# Altium schematic sheet MC_Isolation_Schematic.SchDoc
size A; SheetNumber: 1; SheetTotal: 1
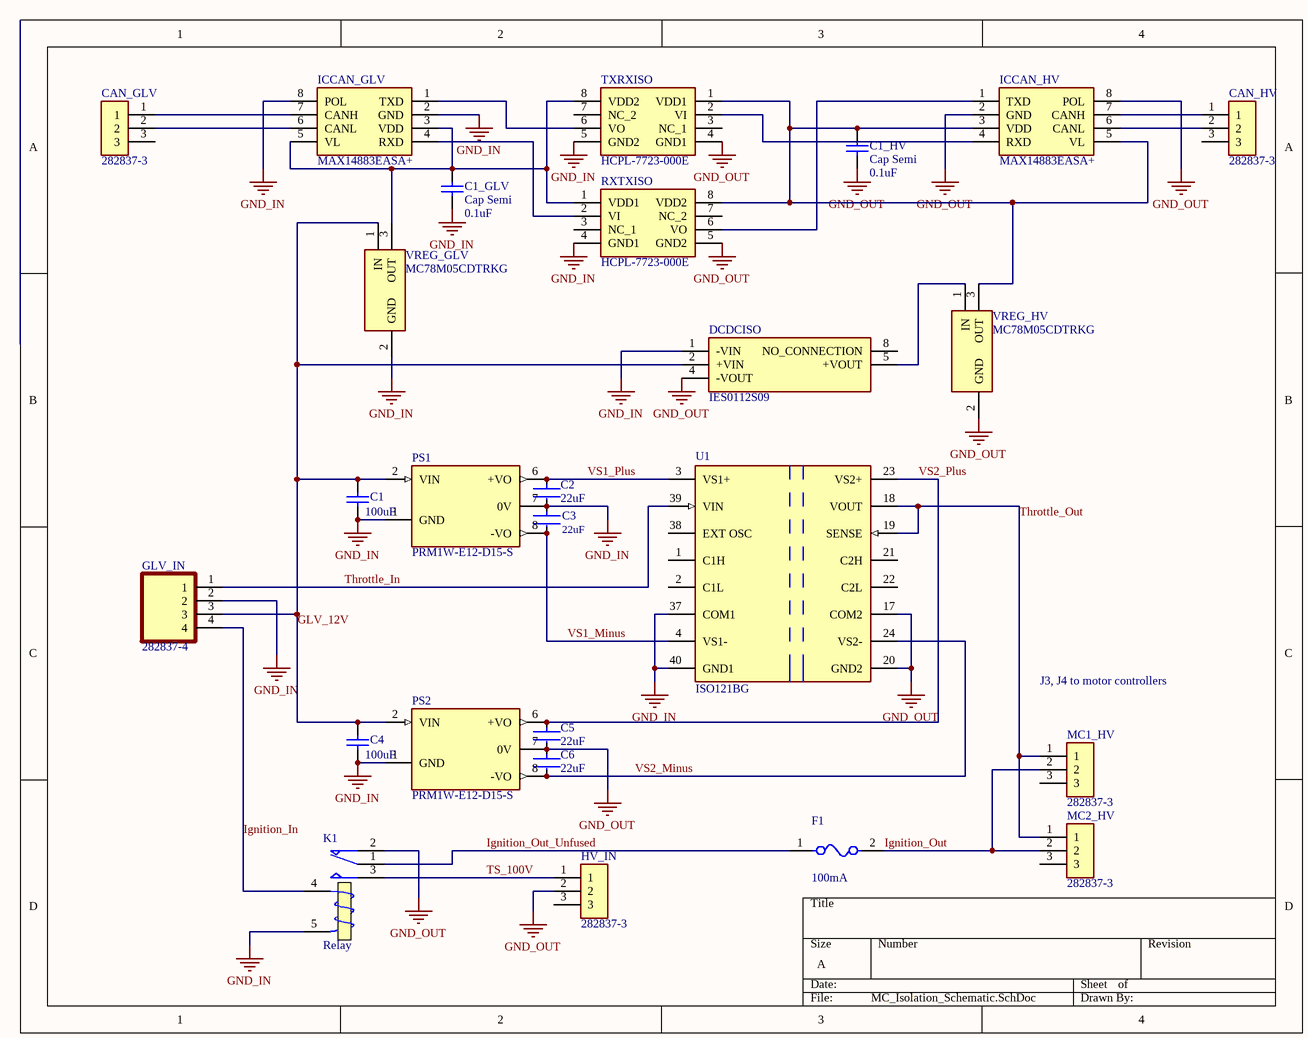
[diagram p0: MC_Isolation_Schematic.SchDoc]

## Parts
C1  100uF  [RAD-0.2]
C1_GLV  Cap Semi  value 0.1uF  [C1206]
C1_HV  Cap Semi  value 0.1uF  [C1206]
C2  22uF  [FP-C3216-160-0_2-IPC_B]
C3  22uF  [FP-C3216-160-0_2-IPC_B]
C4  100uF  [RAD-0.2]
C5  22uF  [FP-C3216-160-0_2-IPC_B]
C6  22uF  [FP-C3216-160-0_2-IPC_B]
CAN_GLV  282837-3  [TE_282837-3]
CAN_HV  282837-3  [TE_282837-3]
DCDCISO  IES0112S09  [IES0105S05H]
F1  100mA  [FP-0154-MFG]
GLV_IN  282837-4  [TE_282837-4]
HV_IN  282837-3  [TE_282837-3]
ICCAN_GLV  MAX14883EASA+  [SOIC127P600X175-8N]
ICCAN_HV  MAX14883EASA+  [SOIC127P600X175-8N]
K1  Relay  [PCBComponent_1]
MC1_HV  282837-3  [TE_282837-3]
MC2_HV  282837-3  [TE_282837-3]
PS1  PRM1W-E12-D15-S  [CONV_PRM1W-E12-D15-S]
PS2  PRM1W-E12-D15-S  [CONV_PRM1W-E12-D15-S]
RXTXISO  HCPL-7723-000E  [DIP762W65P254L965H470Q8N]
TXRXISO  HCPL-7723-000E  [DIP762W65P254L965H470Q8N]
U1  ISO121BG  [FP-JVD0016A-MFG]
VREG_GLV  MC78M05CDTRKG  [LM317MADTRKG]
VREG_HV  MC78M05CDTRKG  [LM317MADTRKG]

## Nets
GND_IN: C1.1 C1_GLV.1 C2.2 C3.1 C4.1 DCDCISO.1(-VIN) GLV_IN.2 ICCAN_GLV.2(GND) ICCAN_GLV.8(POL) K1.5(T2) PS1.1(GND) PS1.7(0V) PS2.1(GND) RXTXISO.4(GND1) TXRXISO.5(GND2) U1.37(COM1) U1.40(GND1) VREG_GLV.2(GND)
GND_OUT: C1_HV.1 C5.2 C6.1 DCDCISO.4(-VOUT) HV_IN.2 ICCAN_HV.2(GND) ICCAN_HV.8(POL) K1.2(NC) PS2.7(0V) RXTXISO.5(GND2) TXRXISO.4(GND1) U1.17(COM2) U1.20(GND2) VREG_HV.2(GND)
GLV_12V: C1.2 C4.2 DCDCISO.2(+VIN) GLV_IN.3 PS1.2(VIN) PS2.2(VIN) VREG_GLV.1(IN)
Ignition_In: GLV_IN.4 K1.4(T1)
Ignition_Out: F1.2 MC1_HV.2 MC2_HV.2
Ignition_Out_Unfused: F1.1 K1.1(COM)
Throttle_In: GLV_IN.1 U1.39(VIN)
Throttle_Out: MC1_HV.1 MC2_HV.1 U1.18(VOUT) U1.19(SENSE)
TS_100V: HV_IN.1 K1.3(NO)
VS1_Minus: C3.2 PS1.8(-VO) U1.4(VS1-)
VS1_Plus: C2.1 PS1.6(+VO) U1.3(VS1+)
VS2_Minus: C6.2 PS2.8(-VO) U1.24(VS2-)
VS2_Plus: C5.1 PS2.6(+VO) U1.23(VS2+)
NetC1_GLV_2: C1_GLV.2 ICCAN_GLV.3(VDD) ICCAN_GLV.5(VL) RXTXISO.1(VDD1) TXRXISO.8(VDD2) VREG_GLV.3(OUT)
NetC1_HV_2: C1_HV.2 ICCAN_HV.3(VDD) ICCAN_HV.5(VL) RXTXISO.8(VDD2) TXRXISO.1(VDD1) VREG_HV.3(OUT)
NetCAN_GLV_1: CAN_GLV.1 ICCAN_GLV.7(CANH)
NetCAN_GLV_2: CAN_GLV.2 ICCAN_GLV.6(CANL)
NetCAN_HV_1: CAN_HV.1 ICCAN_HV.7(CANH)
NetCAN_HV_2: CAN_HV.2 ICCAN_HV.6(CANL)
NetDCDCISO_5: DCDCISO.5(+VOUT) VREG_HV.1(IN)
NetICCAN_GLV_1: ICCAN_GLV.1(TXD) TXRXISO.6(VO)
NetICCAN_GLV_4: ICCAN_GLV.4(RXD) RXTXISO.2(VI)
NetICCAN_HV_1: ICCAN_HV.1(TXD) RXTXISO.6(VO)
NetICCAN_HV_4: ICCAN_HV.4(RXD) TXRXISO.2(VI)

Not connected (* = marked no-connect by the designer): CAN_GLV 3; CAN_HV 3; DCDCISO 8(NO_CONNECTION); HV_IN 3; MC1_HV 3; MC2_HV 3; RXTXISO 3(NC_1) 7(NC_2); TXRXISO 3(NC_1) 7(NC_2); U1 1(C1H) 2(C1L) 21(C2H) 22(C2L) 38(EXT_OSC)

## Notes on the sheet
- J3, J4 to motor controllers

## Library data of the parts
C1 C4 = Cap: Capacitor; Published: 8-Jun-2000; LatestRevisionDate: 17-Jul-2002; LatestRevisionNote: Re-released for DXP Platform.; PackageReference: RAD-0.3; Publisher: Altium Limited; PackageDescription: Radial Cap, Thru-Hole; 2 Leads; 0.3 in Pin Spacing; Value: 100uF
C1_GLV C1_HV = Cap Semi: Capacitor (Semiconductor SIM Model); Published: 8-Jun-2000; LatestRevisionDate: 29-May-2009; LatestRevisionNote: IPC-7351 Footprint Added.; PackageReference: C1206; Publisher: Altium Limited; PackageDescription: Chip Capacitor
C2 C3 C5 C6 = CMP-2000-05402-2: Multilayer Ceramic Capacitors 1uF ±10% 50V X7R SMD 1206; Voltage: 25V; Voltage Rating (DC): 50V; Dielectric: X7R; Number of Pins: 2; Length: 0.126inch; Case Code (Imperial): 1206; Capacitance: 1uF; Package Quantity: 2000; Min Operating Temperature: -55°C; Lead Free: Lead Free; Radiation Hardening: No; Termination: SMD/SMT; Case Code (Metric): 3216; Series: C; Weight: 0.000571oz; REACH SVHC: No SVHC; Tolerance: 10%; Max Operating Temperature: 125°C; RoHS Compliant: Yes; Mount: Surface Mount; Dielectric Material: Ceramic; Packaging: Tape and Reel; Thickness: 0.071inch; Height: 1.6mm; Resistor Type: Ceramic; Width: 0.063inch; Voltage Rating: 50V; Depth: 1.6mm; Case/Package: 1206
CAN_GLV CAN_HV HV_IN MC1_HV MC2_HV = 282837-3: Wire to Board 3 Position 5.08 mm Pitch 30-16 AWG Euro Style Terminal Block; MF: TE Connectivity; Check_prices: https://www.snapeda.com/parts/282837-3/TE%20Connectivity%20AMP%20Connectors/view-part/2765182/?ref=eda; SnapEDA_Link: https://www.snapeda.com/parts/282837-3/TE%20Connectivity%20AMP%20Connectors/view-part/2765182/?ref=snap; Availability: Good; MP: 282837-3; Purchase-URL: https://pricing.snapeda.com/search/part/282837-3/?ref=eda; Package: None; Price: None; Value: *
DCDCISO = IES0105S03: Power Supply; Manufacturer_Name: XP POWER; Datasheet Link: https://www.mouser.com/datasheet/2/942/SF_IES01-1666999.pdf; Height: 7.35mm; Manufacturer_Part_Number: IES0105S03; Mouser Part Number: 209-IES0105S03; Mouser Price/Stock: https://www.mouser.co.uk/ProductDetail/XP-Power/IES0105S03?qs=Cb2nCFKsA8rLXqfTpxCsOw%3D%3D
F1 = CMP-08605-000075-1: FUSE BOARD MNT 100MA 125VAC/VDC; Manufacturer: Littelfuse Inc; Manufacturer Part Number: 0154.100DR; Fuse Current: 0.1A; Fuse I2T: 0.00138A2Sec; Resistance: 3.1Ω; Max Fuse Dc Voltage: 125V; Value: 3.1Ω; Fuse Blow Speed: Fast; Temperature Range High: +125°C; Device Class L1: Circuit Protection; RoHS: TRUE; Lead Free: Yes; ComponentLink2Description: Datasheet; Device Class L3: unset; Digikey Description: FUSE BOARD MNT 100MA 125VAC/VDC; Octopart: https://octopart.com/0154.100dr-littelfuse-557956; Temperature Range Low: -55°C; Mouser Description: Surface Mount Fuses Fuseblck w/ fuse .1A OMNI BLOK 154; Category: Fuse; Max Fuse Ac Voltage: 125V; Height: 3.81mm; Temperature: -55°C to +125°C; Voltage Rating: 125V; Package: 0154; Device Class L2: Fuses; ComponentLink2URL: https://www.littelfuse.com/~/media/electronics/datasheets/fuses/littelfuse_fuse_154_154t_154l_154tl_datasheet.pdf.pdf; Automotive: No
GLV_IN = 282837-4: 4 Position Wire to Board Terminal Block Horizontal with Board 0.200 (5.08mm); MF: TE Connectivity; Check_prices: https://www.snapeda.com/parts/282837-4/TE%20Connectivity%20AMP%20Connectors/view-part/520354/?ref=eda; Purchase-URL: https://pricing.snapeda.com/search/part/282837-4/?ref=eda; Value: *; SnapEDA_Link: https://www.snapeda.com/parts/282837-4/TE%20Connectivity%20AMP%20Connectors/view-part/520354/?ref=snap; EU_RoHS_Compliance: Compliant with Exemptions; Package: None; Availability: Good; Price: None; MP: 282837-4
ICCAN_GLV ICCAN_HV = MAX14883EASA+: Integrated Circuit; Manufacturer_Name: Maxim Integrated; Datasheet Link: https://pdfserv.maximintegrated.com/en/ds/MAX14883E.pdf; Height: 1.75mm; Manufacturer_Part_Number: MAX14883EASA+; Mouser Part Number: 700-MAX14883EASA+; Mouser Price/Stock: https://www.mouser.co.uk/ProductDetail/Maxim-Integrated/MAX14883EASA%2b?qs=u4fy%2FsgLU9On%252BQO2HrFXrQ%3D%3D
K1 = Relay: SPDT Relay; Published: 8-Jun-2000; LatestRevisionDate: 17-Jul-2002; LatestRevisionNote: Re-released for DXP Platform.; PackageReference: MODULE5B; Publisher: Altium Limited
PS1 PS2 = PRM1W-E12-D15-S: 1 W, 8:1 Input Range, Single/Dual Regulated Output, 8 Pin SIP, 3000 Vdc Isolation, Dc-Dc Converter; MF: {'manufacturer': u'CUI'}; Availability: Unavailable; Package: None; MP: PRM1W-E12-D15-S; Value: *; Price: None
RXTXISO TXRXISO = HCPL-7723-000E: Integrated Circuit; Manufacturer_Name: Avago Technologies; Datasheet Link: https://docs.broadcom.com/docs/AV02-0643EN; Height: 4.7mm; Manufacturer_Part_Number: HCPL-7723-000E; Mouser Part Number: 630-HCPL-7723-000E; Mouser Price/Stock: https://www.mouser.co.uk/ProductDetail/Broadcom-Avago/HCPL-7723-000E/?qs=s%252BgfxR24RQ7gIQcj6Xe%2F1Q%3D%3D
U1 = CMP-0998-00014-3: IC OPAMP ISOLATION 1 CIRC 16CDIP; Number of Channels: 1; Input Offset Voltage (Vos): 100mV; -3db Bandwidth: 60kHz; Input Resistance: 200kR; Voltage Gain: 0dB; Operating Supply Voltage: 18V; Min Dual Supply Voltage: 4.5V; Operating Supply Current: 4mA; Output Current per Channel: 15mA; Slew Rate: 2V/µs; Radiation Hardening: No; Number of Circuits: 1; Number of Elements: 1; Lead Free: Lead Free; RoHS Compliant: Yes; Package Quantity: 1; Min Operating Temperature: -55°C; Max Operating Temperature: 125°C; Max Dual Supply Voltage: 18V; Number of Pins: 16; Packaging: Rail/Tube
VREG_GLV VREG_HV = MC78M05CDTRKG: Integrated Circuit; Manufacturer_Name: ON Semiconductor; Datasheet Link: https://docs.rs-online.com/cd82/0900766b814af7ce.pdf; Height: 2.38mm; Manufacturer_Part_Number: MC78M05CDTRKG; Mouser Part Number: 863-MC78M05CDTRKG; Mouser Price/Stock: https://www.mouser.co.uk/ProductDetail/onsemi/MC78M05CDTRKG?qs=%252B9%2Fcbd0IE0SPz25z2gjikg%3D%3D; Arrow Part Number: MC78M05CDTRKG; Arrow Price/Stock: https://www.arrow.com/en/products/mc78m05cdtrkg/on-semiconductor?region=europe